# EAGLE design Buck Sch (EAGLE 9.6.2)
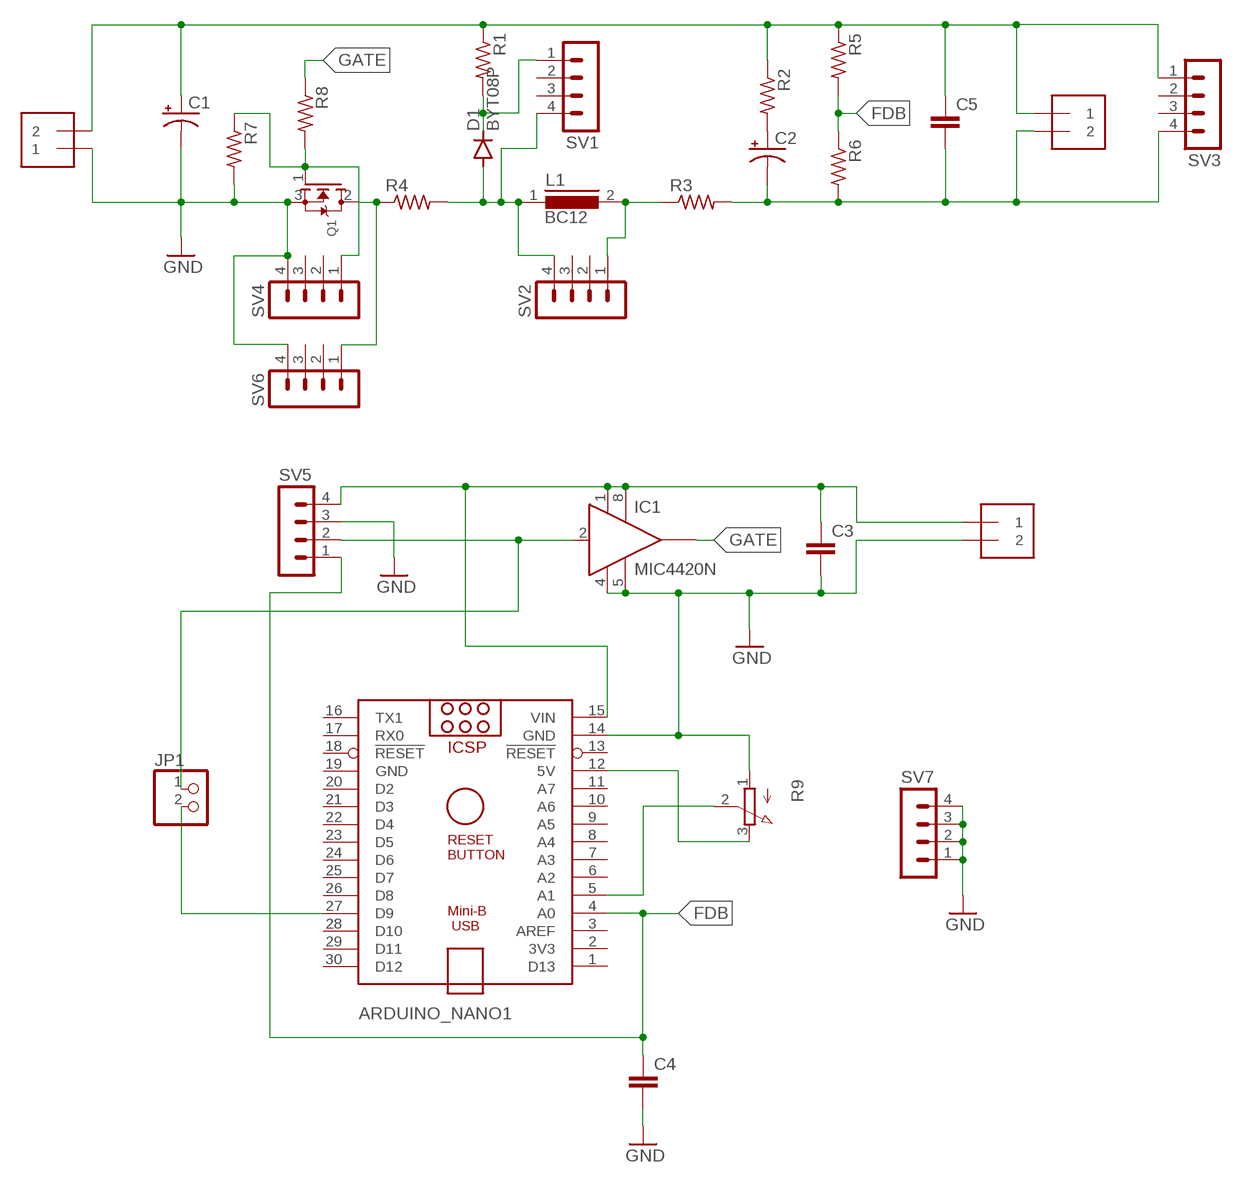
[diagram p0: schematic, sheet 1]

## Parts
ARDUINO_NANO1  ARDUINO_NANO  [ARDUINO_NANO]
C1  CPOL-USE5-10.5  [E5-10,5]
C2  CPOL-USE5-10.5  [E5-10,5]
C3  C2,5-3  [C2.5-3]
C4  C2,5-3  [C2.5-3]
C5  C-EU050-024X044  [C050-024X044]
D1  BYT08P  [TO220ACS]
IC1  MIC4420N  [DIL08]
J1  1X2-3.5MM  [1X2-3.5MM]
J2  1X2-3.5MM  [1X2-3.5MM]
J3  1X2-3.5MM  [1X2-3.5MM]
JP1  PINHD-1X2  [1X02]
L1  BC12  [BC12]
Q1  MOSFET-NGDS_TO220V  [TO220V]
R1  R-US_0414/15  [0414/15]
R2  R-US_0414/15  [0414/15]
R3  R-US_0414/15  [0414/15]
R4  R-US_0414/15  [0414/15]
R5  R-US_0204/7  [0204/7]
R6  R-US_0204/7  [0204/7]
R7  R-US_0204/7  [0204/7]
R8  R-US_0309/12  [0309/12]
R9  3RP/1610N  [3RP/1610N]
SV1  MA04-1  [MA04-1]
SV2  MA04-1  [MA04-1]
SV3  MA04-1  [MA04-1]
SV4  MA04-1  [MA04-1]
SV5  MA04-1  [MA04-1]
SV6  MA04-1  [MA04-1]
SV7  MA04-1  [MA04-1]

## Nets
FDB: ARDUINO_NANO1.4(A0) C4.1 R5.2 R6.1 SV5.1
GATE: IC1.6(OUT) R8.1
GND: ARDUINO_NANO1.14(GND) C1.- C3.2 C4.2 IC1.4(GND) IC1.5(GND1) J1.2 J3.1 Q1.3(S) R7.2 R9.1(A) SV4.4 SV5.3 SV6.4 SV7.1 SV7.2 SV7.3 SV7.4
N$1: C1.+ C5.1 J2.1 J3.2 R1.1 R2.1 R5.1 SV3.1
N$2: ARDUINO_NANO1.5(A1) R9.2(S)
N$3: C2.- C5.2 J2.2 R3.2 R6.2 SV3.4
N$4: D1.A L1.1 R4.2 SV1.4 SV2.4
N$5: D1.C R1.2 SV1.1
N$6: C2.+ R2.2
N$7: L1.2 R3.1 SV2.1
N$8: Q1.2(D) R4.1 SV6.1
N$9: ARDUINO_NANO1.15(VIN) C3.1 IC1.1(VS) IC1.8(VS1) J1.1 SV5.4
N$10: Q1.1(G) R7.1 R8.2 SV4.1
N$11: IC1.2(IN) JP1.1 SV5.2
N$13: ARDUINO_NANO1.12(5V) R9.3(E)
N$14: ARDUINO_NANO1.27(D9) JP1.2
Unconnected: ARDUINO_NANO1.1(D13) ARDUINO_NANO1.2(3V3) ARDUINO_NANO1.3(AREF) ARDUINO_NANO1.6(A2) ARDUINO_NANO1.7(A3) ARDUINO_NANO1.8(A4) ARDUINO_NANO1.9(A5) ARDUINO_NANO1.10(A6) ARDUINO_NANO1.11(A7) ARDUINO_NANO1.13(!RESET) ARDUINO_NANO1.16(TX1) ARDUINO_NANO1.17(RX0) ARDUINO_NANO1.18(!RESET) ARDUINO_NANO1.20(D2) ARDUINO_NANO1.21(D3) ARDUINO_NANO1.22(D4) ARDUINO_NANO1.23(D5) ARDUINO_NANO1.24(D6) ARDUINO_NANO1.25(D7) ARDUINO_NANO1.26(D8) ARDUINO_NANO1.28(D10) ARDUINO_NANO1.29(D11) ARDUINO_NANO1.30(D12) IC1.7(OUT) SV1.2 SV1.3 SV2.2 SV2.3 SV3.2 SV3.3 SV4.2 SV4.3 SV6.2 SV6.3

## Power pins joined to a net without a drawn wire
GND: ARDUINO_NANO1.19(GND)

## Library data of the parts
ARDUINO_NANO1 = ArduinoNanoV30:ARDUINO_NANO: Arduino Nano V3.0 Overview: The Arduino Nano is a small, complete, and breadboard-friendly board based on the ATmega328 (Arduino Nano 3.x) or ATmega168 (Arduino Nano 2.x). It has more or less the same functionality of the Arduino Duemilanove, but in a different package. It lacks only a DC power jack, and works with a Mini-B USB cable instead of a standard one. The Nano was designed and is being produced by Gravitech. Specifications: Microcontroller Atmel ATmega168 or ATmega328 Operating Voltage (logic level) 5 V Input Voltage (recommended) 7-12 V Input Voltage (limits) 6-20 V Digital I/O Pins 14 (of which 6 provide PWM output) Analog Input Pins 8 DC Current per I/O Pin 40 mA Flash Memory 16 KB (ATmega168) or 32 KB (ATmega328) of which 2 KB used by bootloader SRAM 1 KB (ATmega168) or 2 KB (ATmega328) EEPROM 512 bytes (ATmega168) or 1 KB (ATmega328) Clock Speed 16 MHz Dimensions 0.73" x 1.70" Length 45 mm Width 18 mm Weigth 5 g Power: The Arduino Nano can be powered via the Mini-B USB connection, 6-20V unregulated external power supply (pin 30), or 5V regulated external power supply (pin 27). The power source is automatically selected to the highest voltage source. Memory: The ATmega168 has 16 KB of flash memory for storing code (of which 2 KB is used for the bootloader); the ATmega328 has 32 KB, (also with 2 KB used for the bootloader). The ATmega168 has 1 KB of SRAM and 512 bytes of EEPROM (which can be read and written with the EEPROM library); the ATmega328 has 2 KB of SRAM and 1 KB of EEPROM. Input and Output: Each of the 14 digital pins on the Nano can be used as an input or output, using pinMode(), digitalWrite(), and digitalRead() functions. They operate at 5 volts. Each pin can provide or receive a maximum of 40 mA and has an internal pull-up resistor (disconnected by default) of 20-50 kOhms. In addition, some pins have specialized functions. Visit Arduino - ArduinoBoardNano <https://www.arduino.cc/en/Main/ArduinoBoardNano>
C1 C2 = adafruit:CPOL-US: POLARIZED CAPACITOR, American symbol
C3 C4 = capacitor-wima:C: CAPACITOR naming: grid - package width
C5 = rcl:C-EU: CAPACITOR, European symbol; SPICEPREFIX: C
D1 = diode:BYT08P: DIODE ultra fast
IC1 = transistor-power:MIC4420: 6A-Peak Low-Side MOSFET Driver Bipolar/CMOS/DMOS Process http://www.micrel.com/_PDF/mic4420.pdf
J1-J3 = adafruit:1X2: 3.5mm Terminal block http://www.ladyada.net/library/pcb/eaglelibrary.html
JP1 = pinhead:PINHD-1X2: PIN HEADER
L1 = inductors:BC12: INDUCTOR; SPICEPREFIX: L
Q1 = adafruit:MOSFET-N: N-Channel Mosfet 2N7002E - 60V 260mA SOT23 [Digikey: 2N7002ET1GOSTR-ND] - REEL BSH103 - 30V 850mA SOT23 [Digikey: 568-5013-1-ND]
R1-R4 = rcl:R-US_: RESISTOR, American symbol; SPICEPREFIX: R
R5-R8 = adafruit:R-US_: RESISTOR, American symbol
R9 = pot:3RP/1610N: 16mm Potentiometer one level Source: http://www.alphapotentiometers.net/html/16mm_pot_2.html
SV1-SV7 = con-lstb:MA04-1: PIN HEADER; OC_FARNELL: unknown; OC_NEWARK: unknown

## Board
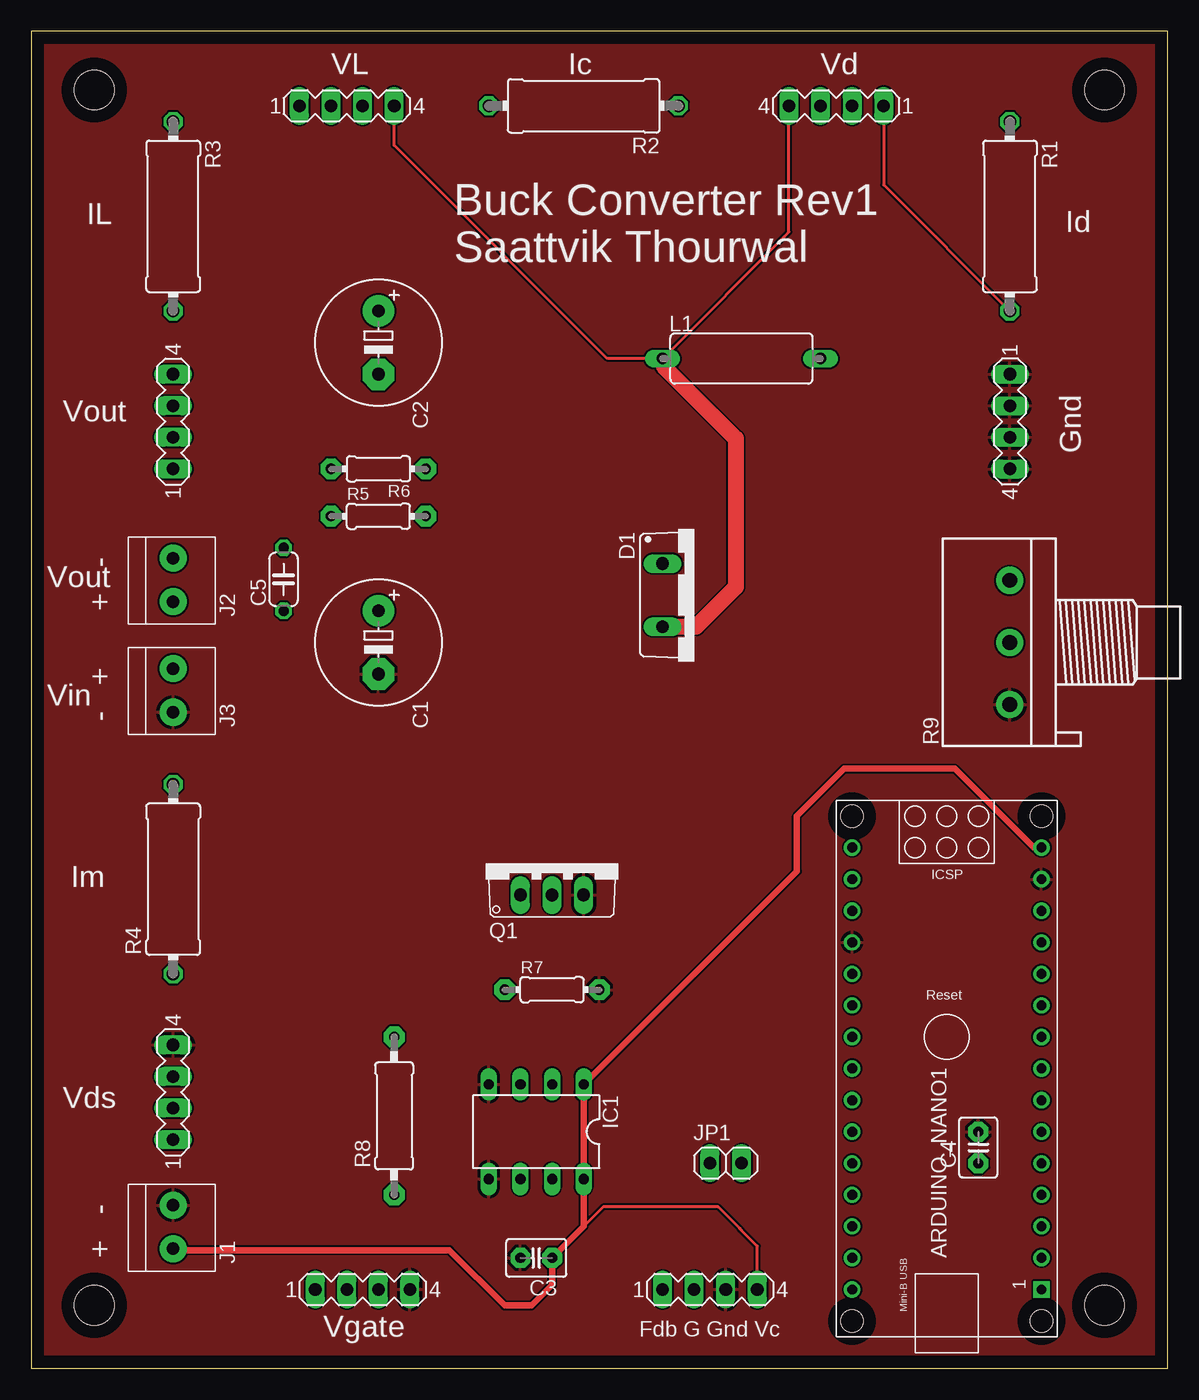
[diagram p1: board, top side]
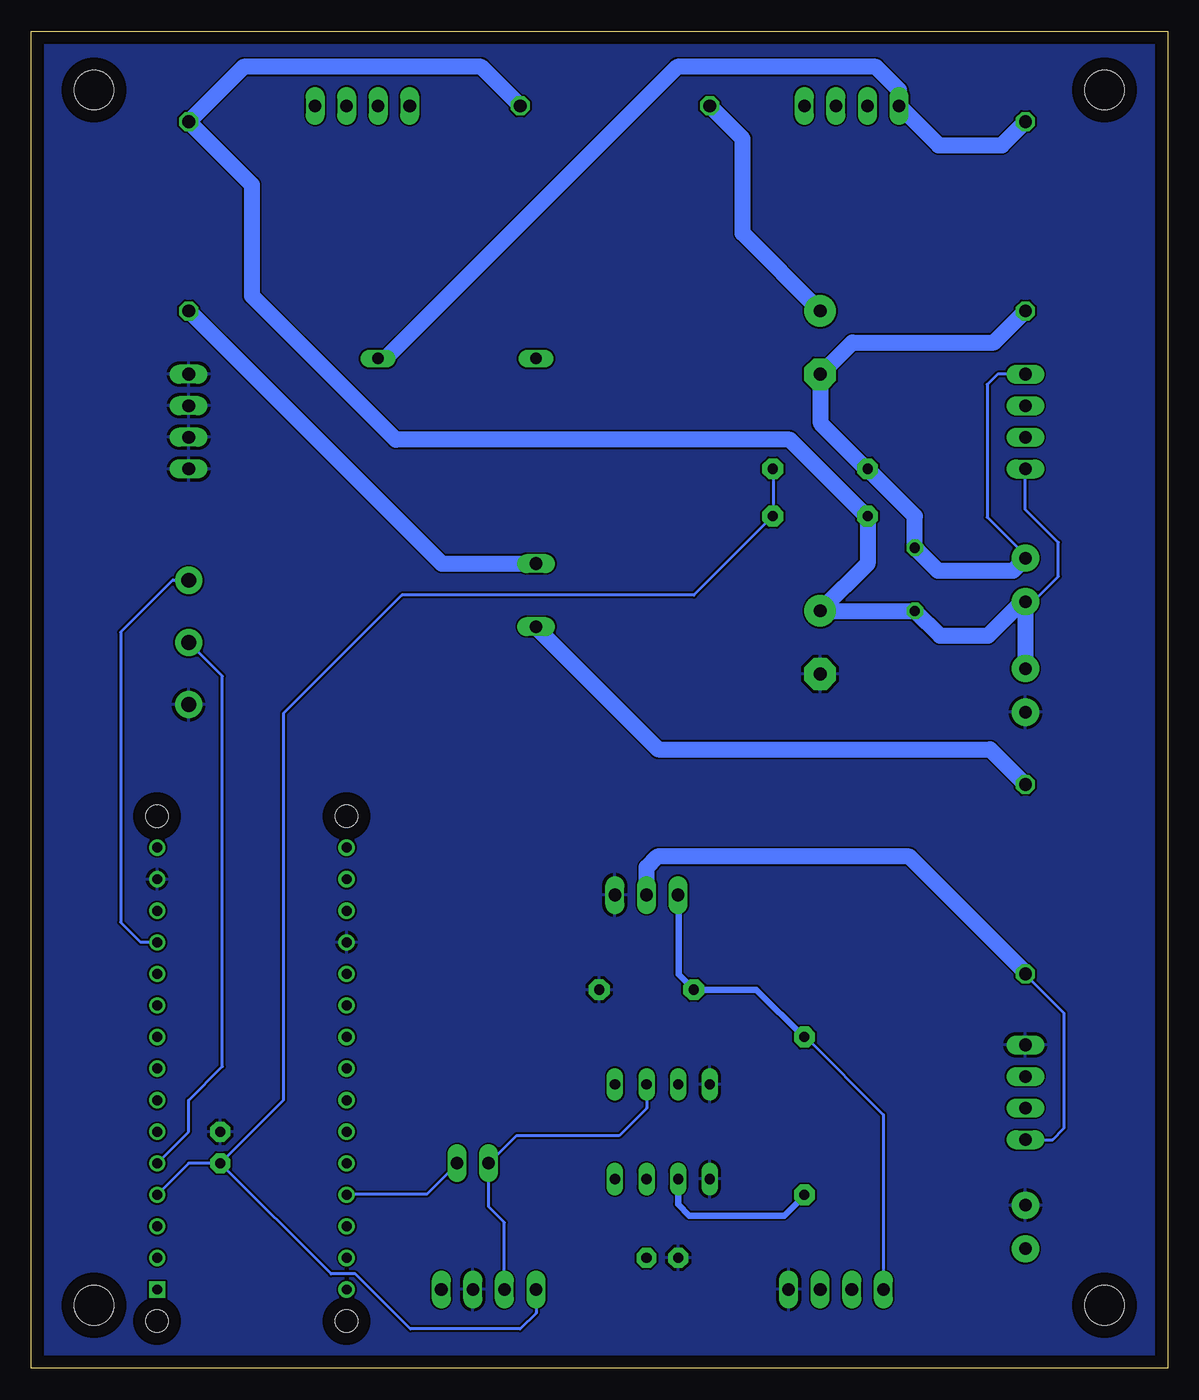
[diagram p2: board, bottom side, seen from below]

Size 91.42 x 107.62 mm. Coordinates in mm from the lower left corner, seen from the top.
Outline: 0,0 91.42,0 91.42,107.62 0,107.62 0,0
Copper layers (1*16): Top 0.035mm / dielectric 1.5mm / Bottom 0.035mm
Design rules "default": minimum track width 6mil, minimum drill 0.35mm, track to track 6mil, track to pad 6mil, pad to pad 6mil, via to via 6mil, smd to smd 6mil, copper to edge 40mil, drill to drill 6mil, minimum pad ring 10mil, minimum via ring 8mil, stop-mask expansion 4mil, vias tented up to drill 0mil, thermal gap 10mil
Holes 3.17 mm at 86.36,102.87 5.08,5.08 5.08,102.87 86.36,5.08

### Footprints (pad centres in the part's own frame; a part is rotated, then mirrored left to right if it is on the bottom)
ARDUINO_NANO = drill 0.8 square: 1 -20.32,-7.62 | drill 0.8: 2 -17.78,-7.62; 3 -15.24,-7.62; 4 -12.7,-7.62; 5 -10.16,-7.62; 6 -7.62,-7.62; 7 -5.08,-7.62; 8 -2.54,-7.62; 9 0,-7.62; 10 2.54,-7.62; 11 5.08,-7.62; 12 7.62,-7.62; 13 10.16,-7.62; 14 12.7,-7.62; 15 15.24,-7.62; 16 15.24,7.62; 17 12.7,7.62; 18 10.16,7.62; 19 7.62,7.62; 20 5.08,7.62; 21 2.54,7.62; 22 0,7.62; 23 -2.54,7.62; 24 -5.08,7.62; 25 -7.62,7.62; 26 -10.16,7.62; 27 -12.7,7.62; 28 -15.24,7.62; 29 -17.78,7.62; 30 -20.32,7.62 | hole 1.778: -22.86,-7.62; -22.86,7.62; 17.78,7.62; 17.78,-7.62
E5-10,5 = drill 1.016 pad 2.54: + -2.54,0 | drill 1.016 pad 2.54 octagon: - 2.54,0
C2.5-3 = drill 0.813 pad 1.6 octagon: 1 -1.27,0; 2 1.27,0
C050-024X044 = drill 0.813 octagon: 1 -2.54,0; 2 2.54,0
TO220ACS = drill 1.016 long: A 2.54,-2.54; C -2.54,-2.54
DIL08 = drill 0.813 long: 1 -3.81,-3.81; 2 -1.27,-3.81; 3 1.27,-3.81; 4 3.81,-3.81; 5 3.81,3.81; 6 1.27,3.81; 7 -1.27,3.81; 8 -3.81,3.81
1X2-3.5MM = drill 1 pad 2.184: 1 1.8,0; 2 -1.7,0
1X02 = drill 1.016 long: 1 -1.27,0; 2 1.27,0
BC12 = drill 0.914 long: 1 -6.35,0; 2 6.35,0
TO220V = drill 1.016 long: 1 -2.54,-2.54; 2 0,-2.54; 3 2.54,-2.54
0414/15 = drill 1.016 octagon: 1 -7.62,0; 2 7.62,0
0204/7 = drill 0.813 pad 1.676 octagon: 1 -3.81,0; 2 3.81,0
0309/12 = drill 0.813 pad 1.676 octagon: 1 -6.35,0; 2 6.35,0
3RP/1610N = drill 1.2 pad 2.184: 1 -5,0; 2 0,0; 3 5,0
MA04-1 = drill 1.016 long: 1 -3.81,0; 2 -1.27,0; 3 1.27,0; 4 3.81,0

### Placement (x,y rotation side)
ARDUINO_NANO1  73.66,26.67 90 top
C1  27.94,58.42 270 top
C2  27.94,82.55 270 top
C3  40.64,8.89 180 top
C4  76.2,17.78 90 top
C5  20.32,63.5 90 top
D1  53.34,62.23 270 top
IC1  40.64,19.05 180 top
J1  11.43,11.43 270 top
J2  11.43,63.5 270 top
J3  11.43,54.61 270 top
JP1  55.88,16.51 0 top
L1  57.15,81.28 0 top
Q1  41.91,40.64 0 top
R1  78.74,92.71 270 top
R2  44.45,101.6 180 top
R3  11.43,92.71 270 top
R4  11.43,39.37 90 top
R5  27.94,68.58 0 top
R6  27.94,72.39 180 top
R7  41.91,30.48 0 top
R8  29.21,20.32 90 top
R9  78.74,58.42 90 top
SV1  64.77,101.6 180 top
SV2  25.4,101.6 0 top
SV3  11.43,76.2 90 top
SV4  26.67,6.35 0 top
SV5  54.61,6.35 0 top
SV6  11.43,22.23 90 top
SV7  78.74,76.2 270 top

### Tracks (layer width: path | path; a pad name or v marks a point on that pad's centre or on a via)
FDB
  Bottom 0.152: 31.7,68.58 R5.2 | 31.7,72.39 R6.1 | 76.1,16.46 C4.1 | 50.75,6.4 SV5.1
  Bottom 0.254: 31.7,72.39 31.7,68.58 | ARDUINO_NANO1.4 78.74,16.51 C4.1 | R5.2 38.1,62.23 61.59,62.23 71.12,52.7 71.12,21.59 C4.1 | SV5.1 50.8,4.45 52.07,3.17 60.91,3.17 65.34,7.6 67.29,7.6 C4.1
GATE
  Bottom 0.152: 29.26,13.87 R8.1
  Bottom 0.508: IC1.6 39.37,13.21 38.46,12.29 30.84,12.29 29.26,13.87
GND
  pour Top: -1.27,109.22 92.71,109.22 92.71,-1.27 -1.27,-1.27
  pour Bottom: -2.54,109.22 93.98,109.22 93.98,-2.54 -2.54,-2.54
N$1
  Bottom 0.152: C1.+ 27.89,60.96 27.89,61.01 | 11.43,60.96 J2.1 11.43,61.57 | 24.23,68.58 R5.1
  Bottom 0.254: SV3.1 11.43,69.11 8.79,66.47 8.79,63.73 10.82,61.7 J2.1
  Bottom 1.27: R2.1 55.22,104.75 74.32,104.75 R1.1 73.66,95.25 73.66,86.31 62.07,74.73 30.38,74.73 24.23,68.58 | 27.89,60.96 C5.1 18.32,58.96 14.43,58.96 11.43,61.96 11.43,60.96 J3.2 | 27.89,61.01 24.13,64.77 R5.1
N$2
  Bottom 0.254: 80.86,16.51 ARDUINO_NANO1.5 78.74,19.05 78.74,21.59 76.03,24.3 76.03,55.72 R9.2
N$3
  Bottom 0.152: 24.08,72.39 R6.2 | 11.43,65.23 J2.2 | 27.89,80.01 C2.-
  Bottom 0.254: 11.43,65.23 11.43,65.44 14.5,68.51 14.5,79.17 13.66,80.01 SV3.4
  Bottom 1.27: R3.2 13.97,82.55 25.35,82.55 27.89,80.01 27.89,76.05 24.23,72.39 R6.2 20.32,68.58 C5.2 18.48,64.2 12.43,64.2 J2.2
N$4
  Top 0.152: 50.9,80.62 50.9,81.23 L1.1
  Top 0.254: SV1.4 60.96,91.44 L1.1 46.35,81.28 29.21,98.42 SV2.4
  Top 1.27: D1.A 53.49,59.69 56.69,62.89 56.69,74.83 50.9,80.62
  Bottom 0.152: 50.75,59.59 D1.A | 50.9,81.23 L1.1
  Bottom 1.27: R4.2 14.26,49.82 40.98,49.82 50.75,59.59
N$5
  Top 0.254: SV1.1 68.58,95.25 R1.2
  Bottom 0.152: 78.64,85.04 R1.2
  Bottom 1.27: D1.C 58.37,64.77 78.64,85.04
N$6
  Bottom 1.27: C2.+ 34.19,91.34 34.19,98.96 R2.2
N$7
  Bottom 0.152: 62.79,81.38 63.4,81.38 L1.2
  Bottom 1.27: 62.79,81.38 39.42,104.75 23.47,104.75 21.59,102.87 SV2.1 18.42,98.43 13.33,98.43 R3.1
N$8
  Bottom 0.152: 11.43,31.7 R4.1 11.43,31.85
  Bottom 0.254: SV6.1 9.25,18.41 8.33,19.33 8.33,28.6 11.43,31.7
  Bottom 1.27: Q1.2 41.91,40.34 41.05,41.2 20.78,41.2 11.43,31.85
N$9
  Top 0.254: SV5.4 58.42,9.84 57.13,11.13 56.99,11.27 55.26,13 46.02,13 44.45,11.43
  Top 0.508: J1.1 11.54,9.53 33.66,9.53 38.1,5.08 40.27,5.08 41.91,6.71 C3.1 44.45,11.43 IC1.8 IC1.1 61.59,40.01 61.59,44.45 65.41,48.26 74.3,48.26 80.64,41.91 ARDUINO_NANO1.15
  Bottom 0.152: 44.35,15.24 IC1.8 | 11.43,9.55 J1.1 | 58.52,6.4 SV5.4 58.37,6.25
N$10
  Bottom 0.152: 39.32,38.1 Q1.1 | 29.11,26.67 R8.2 29.26,26.67
  Bottom 0.254: SV4.1 22.86,20.42 29.11,26.67
  Bottom 0.508: 39.32,38.1 39.32,31.7 R7.1 33.07,30.48 29.26,26.67
N$11
  Bottom 0.254: IC1.2 41.91,20.93 44.11,18.73 52.39,18.73 JP1.1 54.61,13.02 53.34,11.75 SV5.2
N$13
  Bottom 0.254: ARDUINO_NANO1.12 82.6,34.29 84.21,35.9 84.21,59.24 80.01,63.45 78.77,63.45 R9.3
N$14
  Bottom 0.152: 66.04,14.02 ARDUINO_NANO1.27 | 57.15,16.46 JP1.2
  Bottom 0.254: 66.04,14.02 59.59,14.02 57.15,16.46

### Text on the board
tNames: VL | Ic | Vd | IL | Id | Buck Converter Rev1 / Saattvik Thourwal | Vout | Gnd | Vout | + - | Vin | - + | Im | Vds | + - | Vgate | Fdb G Gnd Vc